# Altium schematic sheet Master Diagram.SchDoc
size Letter
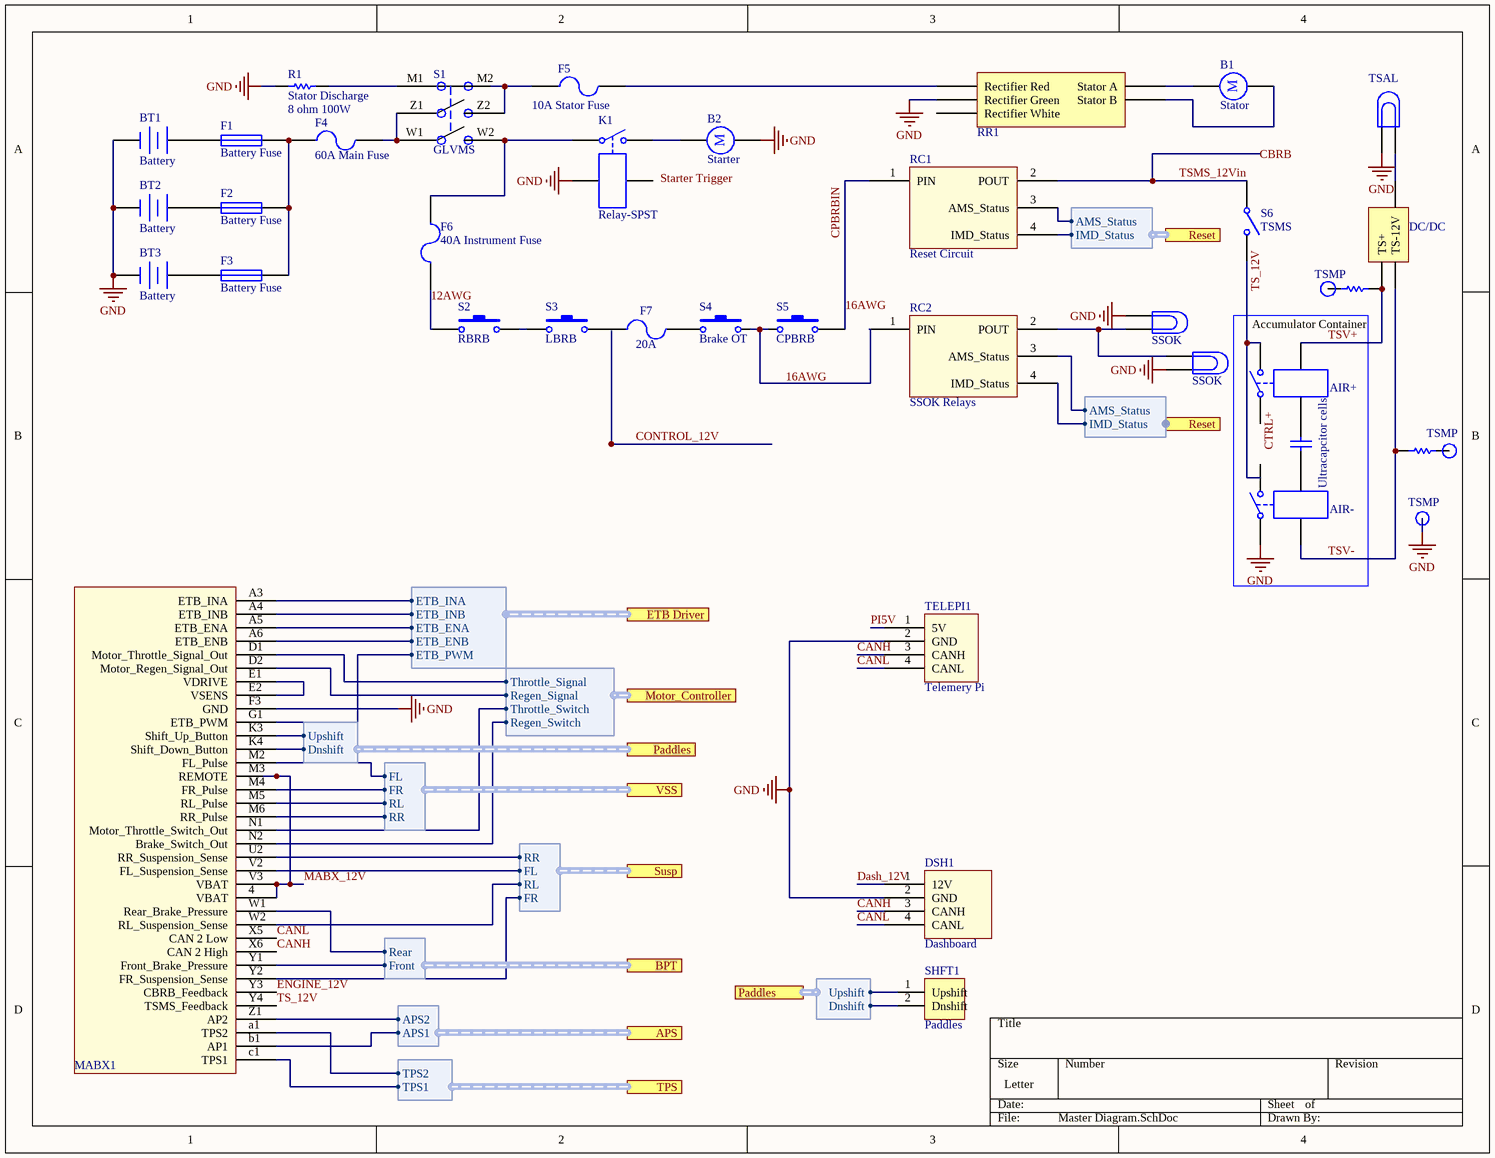
[diagram p0: Master Diagram.SchDoc]

## Parts
B1  Stator  [RB5-10.5]
B2  Starter  [RB5-10.5]
BT1  Battery  [BAT-2]
BT2  Battery  [BAT-2]
BT3  Battery  [BAT-2]
C1  Ultracapcitor cells  [RAD-0.3]
DS1  SSOK  [PIN2]
DS2  SSOK  [PIN2]
DS3  TSAL  [PIN2]
DSH1  Dashboard
F1  Battery Fuse  [PIN-W2/E2.8]
F2  Battery Fuse  [PIN-W2/E2.8]
F3  Battery Fuse  [PIN-W2/E2.8]
F4  60A Main Fuse  [PIN-W2/E2.8]
F5  10A Stator Fuse  [PIN-W2/E2.8]
F6  40A Instrument Fuse  [PIN-W2/E2.8]
F7  20A  [PIN-W2/E2.8]
K1  Relay-SPST  [MODULE4]
K3  AIR+  [MODULE4]
K4  AIR-  [MODULE4]
MABX1  MABX  (value not drawn)
P?  DC/DC  [4Pin Molex]
R1  Stator Discharge  value 8 ohm 100W  [AXIAL-0.3]
R5  Res1  [AXIAL-0.3]  (value not drawn)
R6  Res1  [AXIAL-0.3]  (value not drawn)
RC1  Reset Circuit
RC2  SSOK Relays
RR1  Regulator Rectifier  (value not drawn)
S1  GLVMS
S2  RBRB  [SPST-2]
S3  LBRB  [SPST-2]
S4  Brake OT  [SPST-2]
S5  CPBRB  [SPST-2]
S6  TSMS  [SPST-2]
SHFT1  Paddles  [HDR1X2]
TELEPI1  Telemery Pi

## Ports
APS (harness APS), BPT (harness BPT), ETB Driver (harness ETB Harness), Motor_Controller (harness Motor Controller), Paddles (harness Paddles), Reset (harness Reset), Susp (harness Susp), TPS (harness TPS), VSS (harness VSS)

## Harnesses
ETB Harness: ETB_INA, ETB_INB, ETB_ENA, ETB_ENB, ETB_PWM
Motor Controller: Throttle_Signal, Regen_Signal, Throttle_Switch, Regen_Switch
Paddles: Upshift, Dnshift
VSS: FL, FR, RL, RR
Susp: FL, FR, RL, RR
APS: APS2, APS1
TPS: TPS2, TPS1
BPT: Rear, Front
Reset: AMS_Status, IMD_Status

## Nets
GND: B2.2 BT1.2(-) BT2.2(-) BT3.2(-) DS1.1 DS2.2 DS3.2 DSH1.2(GND) K1.3 K4.1 MABX1.F3(GND) R1.1 RR1.10(Rectifier_Green) TELEPI1.2(GND)
12AWG: F6.2 S2.1
16AWG: RC1.1(PIN) S5.2
CANH: DSH1.3(CANH) MABX1.X6(CAN_2_High) TELEPI1.3(CANH)
CANL: DSH1.4(CANL) MABX1.X5(CAN_2_Low) TELEPI1.4(CANL)
CBRB: RC1.2(POUT) S6.1(COMMON)  [also labelled TSMS_12Vin]
Dash_12V: DSH1.1(12V)
ENGINE_12V: MABX1.Y3(CBRB_Feedback)
MABX_12V: MABX1.4(VBAT) MABX1.M3(REMOTE) MABX1.V3(VBAT)
PI5V: TELEPI1.1(5V)
TS_12V: MABX1.Y4(TSMS_Feedback)
TSV+: K3.4 P?.4(TS+) R6.2
TSV-: K4.3 P?.2(TS-) R5.1
NetB1_1: B1.1 RR1.7(Stator_A)
NetB1_2: B1.2 RR1.8(Stator_B)
NetB2_1: B2.1 K1.2
NetBT1_1: BT1.1(+) F1.1
NetBT2_1: BT2.1(+) F2.1
NetBT3_1: BT3.1(+) F3.1
NetC1_1: C1.1 K4.4
NetC1_2: C1.2 K3.3
NetDS1_2: DS1.2 DS2.1 RC2.2(POUT)
NetDS3_1: DS3.1 P?.1(12V)
NetF1_2: F1.2 F2.2 F3.2 F4.1
NetF4_2: F4.2 S1.W1 S1.Z1
NetF5_1: F5.1 S1.M2 S1.Z2
NetF5_2: F5.2 RR1.9(Rectifier_Red)
NetF6_1: F6.1 K1.1 S1.W2
NetK3_2: K3.2 S6.2(NO)
NetMABX1_a1: MABX1.a1(TPS2) ; port TPS.TPS2
NetMABX1_A3: MABX1.A3(ETB_INA) ; port ETB Driver.ETB_INA
NetMABX1_A4: MABX1.A4(ETB_INB) ; port ETB Driver.ETB_INB
NetMABX1_A5: MABX1.A5(ETB_ENA) ; port ETB Driver.ETB_ENA
NetMABX1_A6: MABX1.A6(ETB_ENB) ; port ETB Driver.ETB_ENB
NetMABX1_b1: MABX1.b1(AP1) ; port APS.APS1
NetMABX1_c1: MABX1.c1(TPS1) ; port TPS.TPS1
NetMABX1_D1: MABX1.D1(Motor_Throttle_Signal_Out) ; port Motor_Controller.Throttle_Signal
NetMABX1_D2: MABX1.D2(Motor_Regen_Signal_Out) ; port Motor_Controller.Regen_Signal
NetMABX1_E1: MABX1.E1(VDRIVE) MABX1.E2(VSENS)
NetMABX1_G1: MABX1.G1(ETB_PWM) ; port ETB Driver.ETB_PWM
NetMABX1_K3: MABX1.K3(Shift_Up_Button) SHFT1.1(Upshift) ; port Paddles.Upshift
NetMABX1_K4: MABX1.K4(Shift_Down_Button) SHFT1.2(Dnshift) ; port Paddles.Dnshift
NetMABX1_M2: MABX1.M2(FL_Pulse) ; port VSS.FL
NetMABX1_M4: MABX1.M4(FR_Pulse) ; port VSS.FR
NetMABX1_M5: MABX1.M5(RL_Pulse) ; port VSS.RL
NetMABX1_M6: MABX1.M6(RR_Pulse) ; port VSS.RR
NetMABX1_N1: MABX1.N1(Motor_Throttle_Switch_Out) ; port Motor_Controller.Throttle_Switch
NetMABX1_N2: MABX1.N2(Brake_Switch_Out) ; port Motor_Controller.Regen_Switch
NetMABX1_U2: MABX1.U2(RR_Suspension_Sense) ; port Susp.RR
NetMABX1_V2: MABX1.V2(FL_Suspension_Sense) ; port Susp.FL
NetMABX1_W1: MABX1.W1(Rear_Brake_Pressure) ; port BPT.Rear
NetMABX1_W2: MABX1.W2(RL_Suspension_Sense) ; port Susp.RL
NetMABX1_Y1: MABX1.Y1(Front_Brake_Pressure) ; port BPT.Front
NetMABX1_Y2: MABX1.Y2(FR_Suspension_Sense) ; port Susp.FR
NetMABX1_Z1: MABX1.Z1(AP2) ; port APS.APS2
NetR1_2: R1.2 S1.M1
NetRC1_3: RC1.3(AMS_Status) RC2.3(AMS_Status) ; port Reset.AMS_Status
NetRC1_4: RC1.4(IMD_Status) RC2.4(IMD_Status) ; port Reset.IMD_Status
NetRC2_1: RC2.1(PIN) S4.2 S5.1
NetS2_2: S2.2 S3.1

Not connected (* = marked no-connect by the designer): F7 1 2; K1 4; K3 1; K4 2; P? 3; R5 2; R6 1; RR1 11(Rectifier_White); S3 2; S4 1

## Notes on the sheet
- (near R6) TSMP
- (near R5) TSMP
- Accumulator Container
- Labels drawn without touching a wire or pin: 16AWG, CPBRBIN, CTRL+, Starter Trigger, TS_12V
- (in symbol Motor) M

## Library data of the parts
B1 B2 = Motor: Motor, General Kind; Published: 24-Mar-1999; LatestRevisionDate: 17-Jul-2002; LatestRevisionNote: Re-released for DXP Platform.; PackageReference: RB5-10.5; Publisher: Altium Limited; PackageDescription: Capacitor (Radial); 2 Leads
BT1-BT3 = Battery: Multicell Battery; Published: 24-Mar-1999; LatestRevisionDate: 17-Jul-2002; LatestRevisionNote: Re-released for DXP Platform.; PackageReference: BAT-2; Publisher: Altium Limited; PackageDescription: Battery; 2 Leads
C1 = Cap: Capacitor; Value: 100pF; Published: 8-Jun-2000; LatestRevisionDate: 17-Jul-2002; LatestRevisionNote: Re-released for DXP Platform.; PackageReference: RAD-0.3; Publisher: Altium Limited; PackageDescription: Radial Cap, Thru-Hole; 2 Leads; 0.3 in Pin Spacing
DS1-DS3 = Lamp: Incandescent Bulb; Published: 24-Mar-1999; LatestRevisionDate: 17-Jul-2002; LatestRevisionNote: Re-released for DXP Platform.; PackageReference: PIN2; Publisher: Altium Limited
DSH1 = Dash: Dashboard Connector
F1-F3 = Fuse 1: Fuse; Published: 8-Jun-2000; LatestRevisionDate: 17-Jul-2002; LatestRevisionNote: Re-released for DXP Platform.; PackageReference: PIN-W2/E2.8; Publisher: Altium Limited; PackageDescription: Thru-Hole; 2 Leads
F4-F7 = Fuse 2: Fuse; Published: 8-Jun-2000; LatestRevisionDate: 17-Jul-2002; LatestRevisionNote: Re-released for DXP Platform.; PackageReference: PIN-W2/E2.8; Publisher: Altium Limited; PackageDescription: Thru-Hole; 2 Leads
K1 K3 K4 = Relay-SPST: Single-Pole Single-Throw Relay; Published: 24-Mar-1999; LatestRevisionDate: 17-Jul-2002; LatestRevisionNote: Re-released for DXP Platform.; PackageReference: MODULE4; Publisher: Altium Limited
MABX1 = MABX: MicroAutoBox II in 2019 Layout V1
P? = 4Pin Molex: Supplier Part Number: WM3801-ND
R1 = Res1: Resistor; Published: 8-Jun-2000; LatestRevisionDate: 17-Jul-2002; LatestRevisionNote: Re-released for DXP Platform.; PackageReference: AXIAL-0.3; Publisher: Altium Limited; PackageDescription: Axial Device, Thru-Hole; 2 Leads; 0.3 in Pin Spacing
R5 R6 = Res1: Resistor; Value: 1K; Published: 8-Jun-2000; LatestRevisionDate: 17-Jul-2002; LatestRevisionNote: Re-released for DXP Platform.; PackageReference: AXIAL-0.3; Publisher: Altium Limited; PackageDescription: Axial Device, Thru-Hole; 2 Leads; 0.3 in Pin Spacing
RC1 RC2 = Reset: Reset Circuit for 2019 Rules
RR1 = Stator Rectifier
S2-S5 = SW-PB: Switch; Published: 24-Mar-1999; LatestRevisionDate: 17-Jul-2002; LatestRevisionNote: Re-released for DXP Platform.; PackageReference: SPST-2; Publisher: Altium Limited; PackageDescription: Switch; 2 Leads
S6 = SW-SPST: Single-Pole, Single-Throw Switch; Published: 24-Mar-1999; LatestRevisionDate: 17-Jul-2002; LatestRevisionNote: Re-released for DXP Platform.; PackageReference: SPST-2; Publisher: Altium Limited; PackageDescription: Switch; 2 Leads
SHFT1 = Header 2: Header, 2-Pin; LatestRevisionDate: 17-Jul-2002; LatestRevisionNote: Re-released for DXP Platform.; Publisher: Altium Limited
TELEPI1 = TELEPI: Raspberry Pi used for telemetry